# Altium schematic sheet CC1125_ref.SchDoc
size A4; SheetNumber: 1; SheetTotal: 1
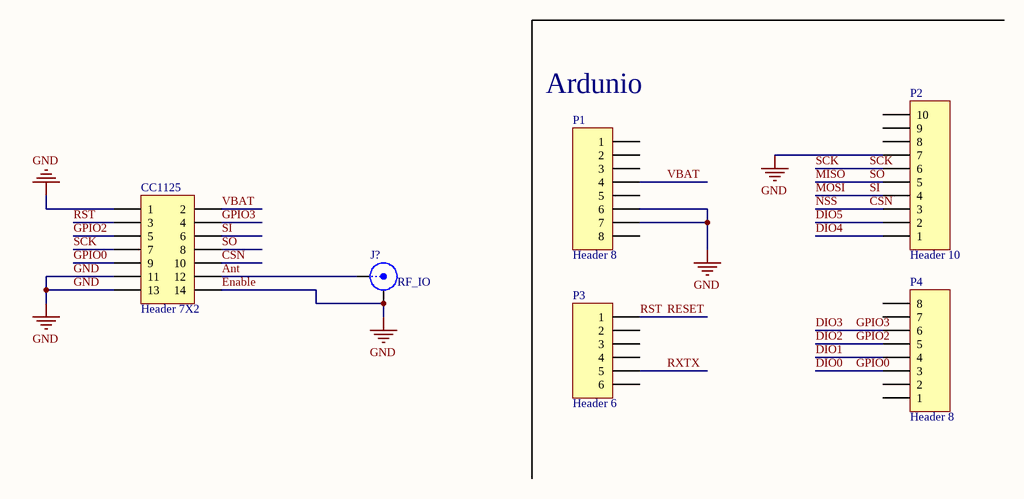
[diagram p0: CC1125_ref.SchDoc]

## Parts
CC1125  Header 7X2  [CC1125-TR-4S]
J?  RF_IO  [PCBComponent_1]
P1  Header 8  [HDR1X8]
P2  Header 10  [HDR1X10]
P3  Header 6  [HDR1X6]
P4  Header 8  [HDR1X8]

## Nets
Enable: CC1125.1 CC1125.11 CC1125.13 CC1125.14 J?.2(Y) P1.6 P1.7 P2.7  [also labelled GND]
Ant: CC1125.12 J?.1(X)
CSN: CC1125.10 P2.3  [also labelled NSS]
DIO0: CC1125.9 P4.3  [also labelled GPIO0]
DIO1: P4.4
DIO2: CC1125.5 P4.5  [also labelled GPIO2]
DIO3: CC1125.4 P4.6  [also labelled GPIO3]
DIO4: P2.1
DIO5: P2.2
MISO: CC1125.8 P2.5  [also labelled SO]
MOSI: CC1125.6 P2.4  [also labelled SI]
RESET: CC1125.3 P3.1  [also labelled RST]
RXTX: P3.5
SCK: CC1125.7 P2.6
VBAT: CC1125.2 P1.4

Not connected (* = marked no-connect by the designer): P1 1 2 3 5 8; P2 8 9 10; P3 2 3 4 6; P4 1 2 7 8

## Notes on the sheet
- (near P1) Ardunio
- Labels drawn without touching a wire or pin: \

## Library data of the parts
CC1125 = Header 7X2: Header, 7-Pin, Dual row; LatestRevisionDate: 17-Jul-2002; LatestRevisionNote: Re-released for DXP Platform.; Publisher: Altium Limited
J? = SMB: SMB Straight Connector; LatestRevisionDate: 17-Jul-2002; LatestRevisionNote: Re-released for DXP Platform.; Publisher: Altium Limited
P1 P4 = Header 8: Header, 8-Pin; LatestRevisionDate: 17-Jul-2002; LatestRevisionNote: Re-released for DXP Platform.; Publisher: Altium Limited
P2 = Header 10: Header, 10-Pin; LatestRevisionDate: 17-Jul-2002; LatestRevisionNote: Re-released for DXP Platform.; Publisher: Altium Limited
P3 = Header 6: Header, 6-Pin; LatestRevisionDate: 17-Jul-2002; LatestRevisionNote: Re-released for DXP Platform.; Publisher: Altium Limited